# Altium schematic sheet ESP32_DevKitC_v4.SchDoc
size 513 x 386 mm
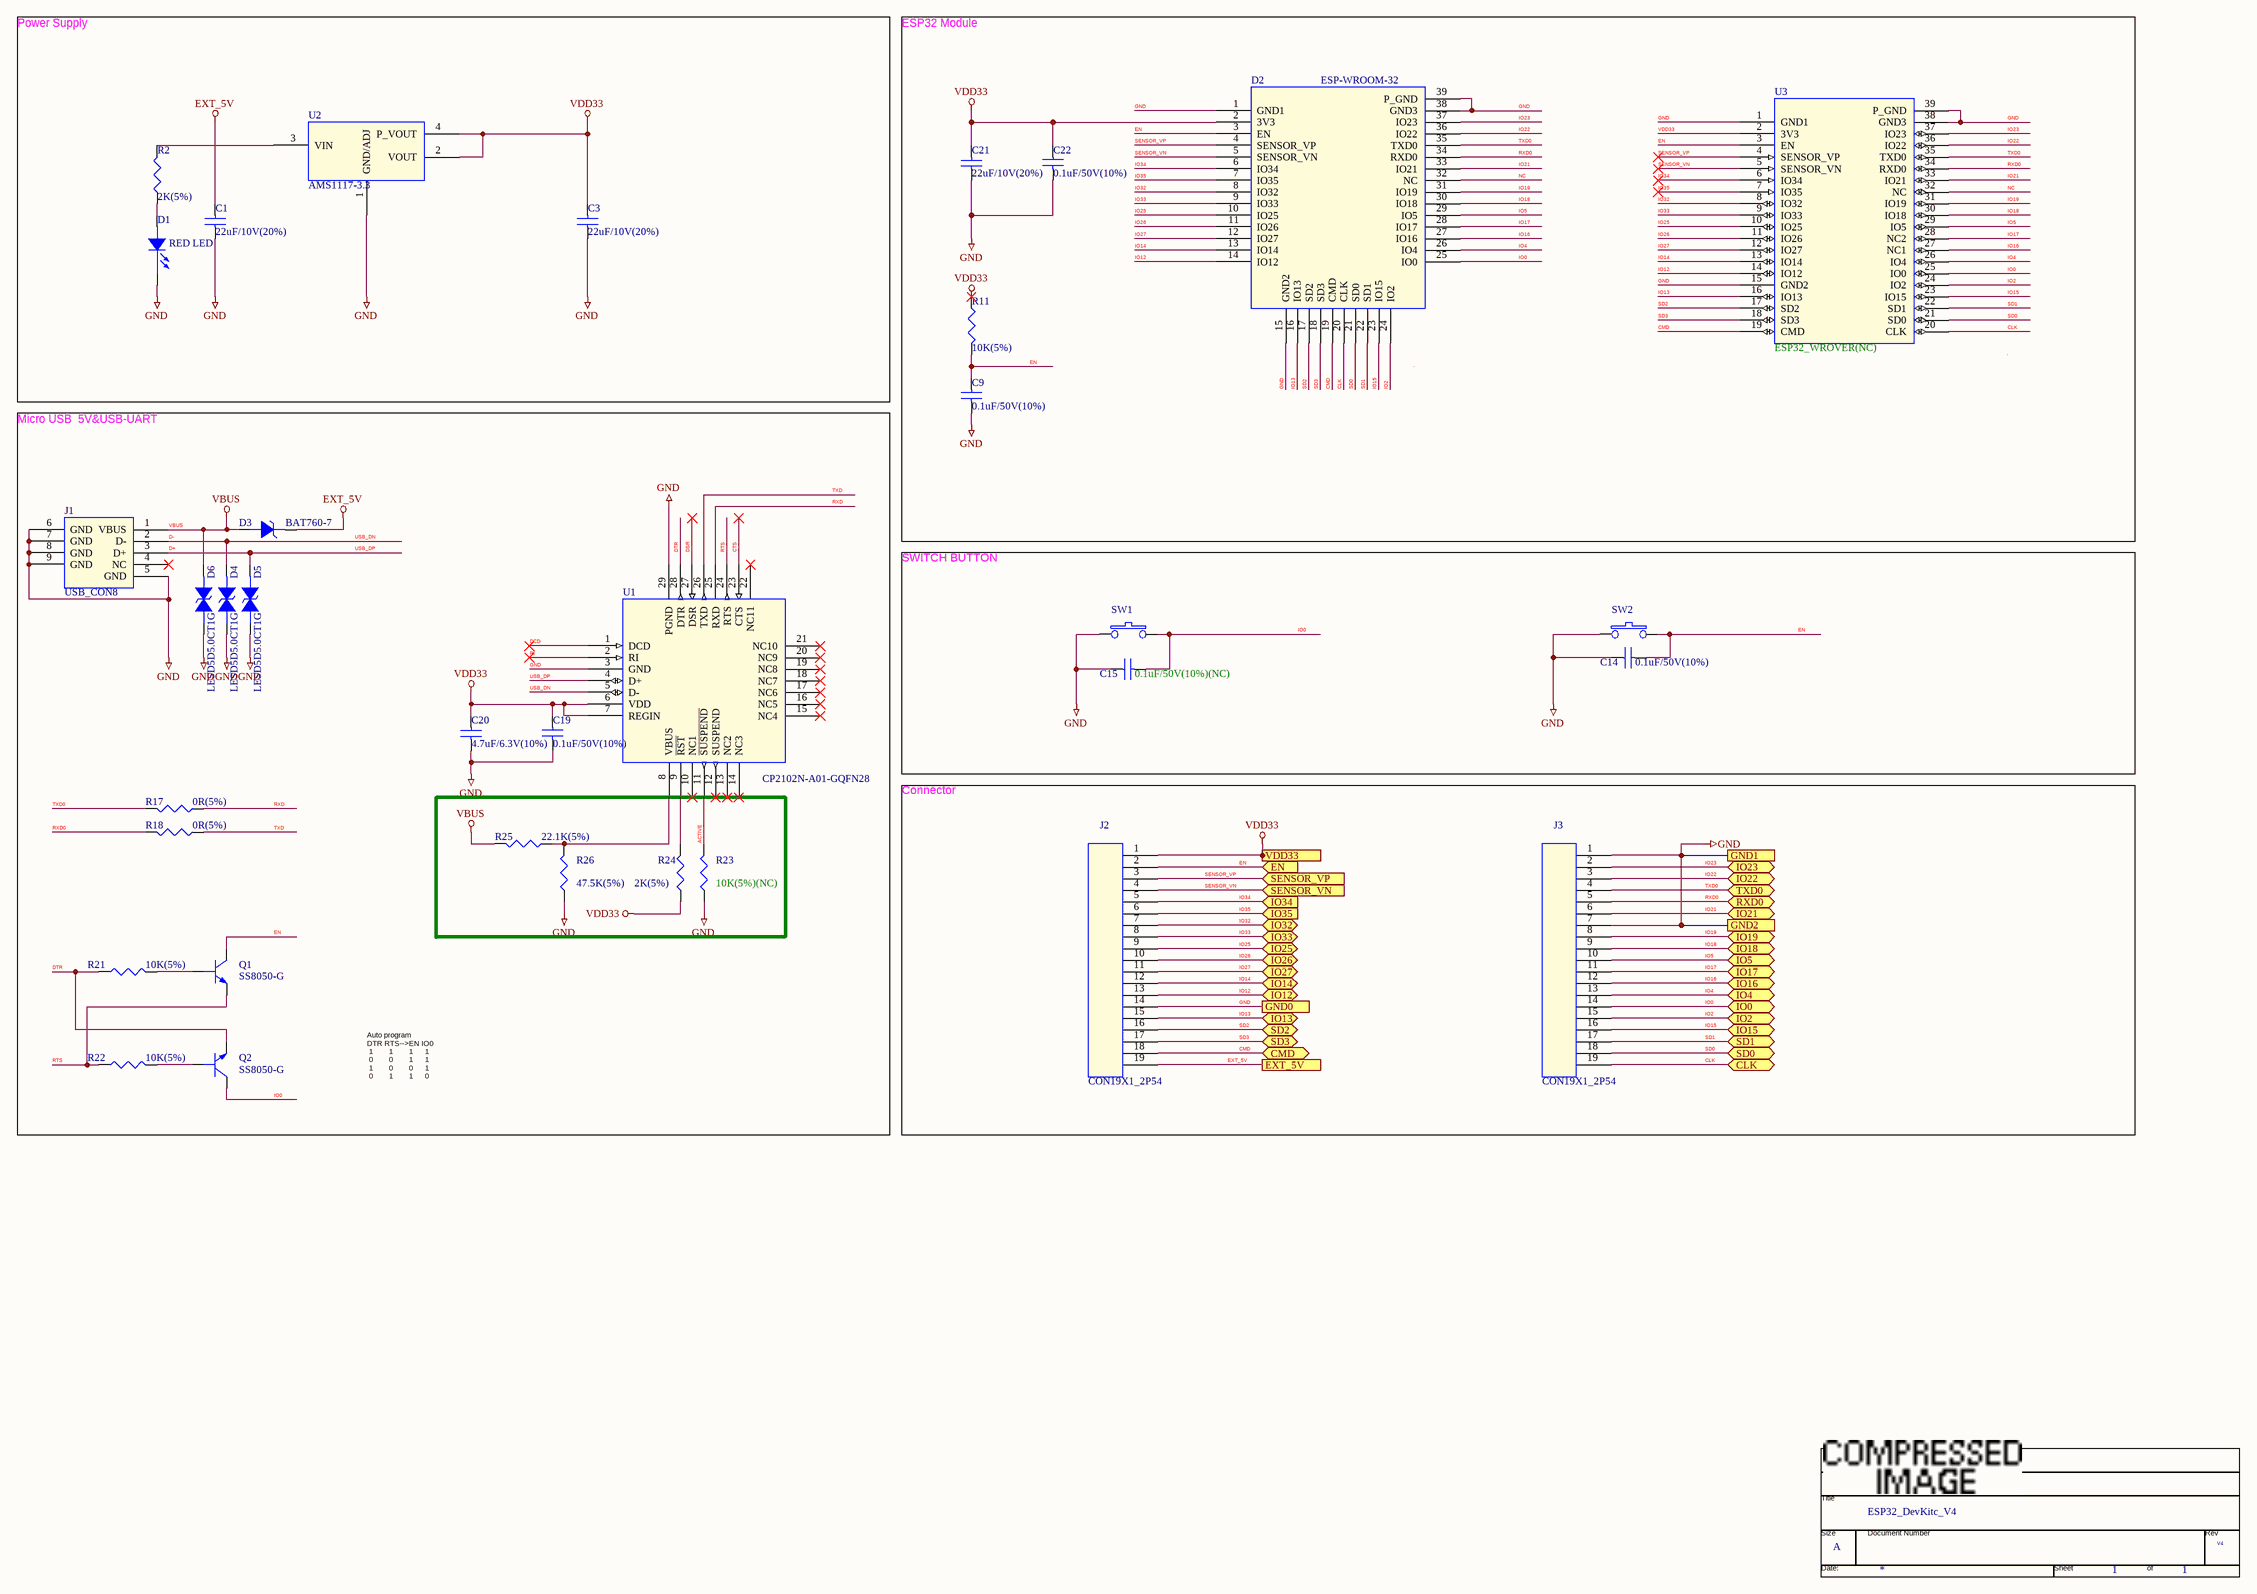
[diagram p0: ESP32_DevKitC_v4.SchDoc]

## Parts
*  RevCode: V4  Title: ESP32_DevKitc_V4  Page Size: A  Page Number: 1  (hidden comment: TitleBlock0)  (graphical)
C1  22uF/10V(20%)  [C0603]
C3  22uF/10V(20%)  [C0603]
C9  0.1uF/50V(10%)  [C0402]
C14  0.1uF/50V(10%)  [C0402]
C15  0.1uF/50V(10%)(NC)  [C0402]
C19  0.1uF/50V(10%)  [C0402]
C20  4.7uF/6.3V(10%)  [C0402]
C21  22uF/10V(20%)  [C0603]
C22  0.1uF/50V(10%)  [C0402]
D1  RED LED  [0603D/A]
D2  ESP-WROOM-32  [ESP32_MODULE]
D3  BAT760-7  [SOD323]
D4  LESD5D5.0CT1G  [ESD0402]
D5  LESD5D5.0CT1G  [ESD0402]
D6  LESD5D5.0CT1G  [ESD0402]
J1  USB_CON8  [USB_5P]
J2  CON19X1_2P54  [CON19_2P54]
J3  CON19X1_2P54  [CON19_2P54]
Q1  SS8050-G  [SOT-23-3]
Q2  SS8050-G  [SOT-23-3]
R2  2K(5%)  [R0402]
R11  10K(5%)  [R0402]
R17  0R(5%)  [R0402]
R18  0R(5%)  [R0402]
R21  10K(5%)  [R0402]
R22  10K(5%)  [R0402]
R23  10K(5%)(NC)  [R0402]
R24  2K(5%)  [R0402]
R25  22.1K(5%)  [R0402]
R26  47.5K(5%)  [R0402]
SW1  SW PUSHBUTTON  [SW_3X4X2MM]  (value not drawn)
SW2  SW PUSHBUTTON  [SW_3X4X2MM]  (value not drawn)
U1  CP2102N-A01-GQFN28  [CP2102_QFN_28P]
U2  AMS1117-3.3  [SOT-223]
U3  ESP32_WROVER(NC)  [ESP32_MODULE_2COL]

## Blocks framed on the sheet
Power Supply: C1 C3 D1 R2 U2
ESP32 Module: C9 C21 C22 D2 R11 U3
Micro USB  5V&USB-UART: C19 C20 D3-D6 J1 Q1 Q2 R17 R18 R21-R26 U1
SWITCH BUTTON: C14 C15 SW1 SW2
Connector: J2 J3

## Ports
CLK (bidir), CMD (bidir), EN (in), EXT_5V, GND0, GND1, GND2, IO0 (bidir), IO2 (bidir), IO4 (bidir), IO5 (bidir), IO12 (bidir), IO13 (bidir), IO14 (bidir), IO15 (bidir), IO16 (bidir), IO17 (bidir), IO18 (bidir), IO19 (bidir), IO21 (bidir), IO22 (bidir), IO23 (bidir), IO25 (bidir), IO26 (bidir), IO27 (bidir), IO32 (bidir), IO33 (bidir), IO34 (in), IO35 (in), RXD0 (bidir), SD0 (bidir), SD1 (bidir), SD2 (bidir), SD3 (bidir), SENSOR_VN (in), SENSOR_VP (in), TXD0 (bidir), VDD33

## Nets
EXT_5V: C1.2 D3.1 J2.19 ; port EXT_5V
GND: C1.1 C3.1 C9.2 C14.1 C15.1 C19.2 C20.1 C21.1 C22.2 D1.2(CATHODE) D2.1(GND1) D2.15(GND2) D2.38(GND3) D2.39(P_GND) D4.2 D5.2 D6.2 J1.5(GND) J1.6(GND) J1.7(GND) J1.8(GND) J1.9(GND) J2.14 J3.1 J3.7 R23.1 R26.1 SW1.1 SW2.1 U1.3(GND) U1.29(PGND) U2.1(GND/ADJ) U3.1(GND1) U3.15(GND2) U3.38(GND3) U3.39(P_GND) ; port GND1, port GND0, port GND2
VBUS: D3.2 D6.1 J1.1(VBUS) R25.2
VDD33: C3.2 C19.1 C20.2 C21.2 C22.1 D2.2(3V3) J2.1 R11.1 R24.1 U1.6(VDD) U1.7(REGIN) U2.2(VOUT) U2.4(P_VOUT) U3.2(3V3) ; port VDD33
ACTIVE: R23.2 U1.11(~{SUSPEND})
CLK: D2.20(CLK) J3.19 U3.20(CLK) ; port CLK
CMD: D2.19(CMD) J2.18 U3.19(CMD) ; port CMD
CTS: U1.23(CTS)
D+: D5.1 J1.3(D+) U1.4(D+)  [also labelled USB_DP]
D-: D4.1 J1.2(D-) U1.5(D-)  [also labelled USB_DN]
DCD: U1.1(DCD)
DSR: U1.27(DSR)
DTR: Q2.2(E) R21.1 U1.28(DTR)
EN: C9.1 C14.2 D2.3(EN) J2.2 Q1.3(C) R11.2 SW2.2 U3.3(EN) ; port EN
IO0: C15.2 D2.25(IO0) J3.14 Q2.3(C) SW1.2 U3.25(IO0) ; port IO0
IO2: D2.24(IO2) J3.15 U3.24(IO2) ; port IO2
IO4: D2.26(IO4) J3.13 U3.26(IO4) ; port IO4
IO5: D2.29(IO5) J3.10 U3.29(IO5) ; port IO5
IO12: D2.14(IO12) J2.13 U3.14(IO12) ; port IO12
IO13: D2.16(IO13) J2.15 U3.16(IO13) ; port IO13
IO14: D2.13(IO14) J2.12 U3.13(IO14) ; port IO14
IO15: D2.23(IO15) J3.16 U3.23(IO15) ; port IO15
IO16: D2.27(IO16) J3.12 U3.27(NC1) ; port IO16
IO17: D2.28(IO17) J3.11 U3.28(NC2) ; port IO17
IO18: D2.30(IO18) J3.9 U3.30(IO18) ; port IO18
IO19: D2.31(IO19) J3.8 U3.31(IO19) ; port IO19
IO21: D2.33(IO21) J3.6 U3.33(IO21) ; port IO21
IO22: D2.36(IO22) J3.3 U3.36(IO22) ; port IO22
IO23: D2.37(IO23) J3.2 U3.37(IO23) ; port IO23
IO25: D2.10(IO25) J2.9 U3.10(IO25) ; port IO25
IO26: D2.11(IO26) J2.10 U3.11(IO26) ; port IO26
IO27: D2.12(IO27) J2.11 U3.12(IO27) ; port IO27
IO32: D2.8(IO32) J2.7 U3.8(IO32) ; port IO32
IO33: D2.9(IO33) J2.8 U3.9(IO33) ; port IO33
IO34: D2.6(IO34) J2.5 U3.6(IO34) ; port IO34
IO35: D2.7(IO35) J2.6 U3.7(IO35) ; port IO35
NC: D2.32(NC) U3.32(NC)
RI: U1.2(RI)
RTS: Q1.2(E) R22.1 U1.24(RTS)
RXD: R17.1 U1.25(RXD)
RXD0: D2.34(RXD0) J3.5 R18.2 U3.34(RXD0) ; port RXD0
SD0: D2.21(SD0) J3.18 U3.21(SD0) ; port SD0
SD1: D2.22(SD1) J3.17 U3.22(SD1) ; port SD1
SD2: D2.17(SD2) J2.16 U3.17(SD2) ; port SD2
SD3: D2.18(SD3) J2.17 U3.18(SD3) ; port SD3
SENSOR_VN: D2.5(SENSOR_VN) J2.4 U3.5(SENSOR_VN) ; port SENSOR_VN
SENSOR_VP: D2.4(SENSOR_VP) J2.3 U3.4(SENSOR_VP) ; port SENSOR_VP
TXD: R18.1 U1.26(TXD)
TXD0: D2.35(TXD0) J3.4 R17.2 U3.35(TXD0) ; port TXD0
NetD1_1: D1.1(ANODE) R2.2
NetQ1_1: Q1.1(B) R21.2
NetQ2_1: Q2.1(B) R22.2
NetR2_1: R2.1 U2.3(VIN)
NetR24_2: R24.2 U1.9(~{RST})
NetR25_1: R25.1 R26.2 U1.8(VBUS)

Not connected (* = marked no-connect by the designer): J1 4(NC)*; U1 10(NC1)* 12(SUSPEND)* 13(NC2)* 14(NC3)* 15(NC4)* 16(NC5)* 17(NC6)* 18(NC7)* 19(NC8)* 20(NC9)* 21(NC10)* 22(NC11)*

## Notes on the sheet
- Auto program
  DTR RTS-->EN IO0
  1        1        1      1
  0        0        1      1
  1        0        0      1
  0        1        1      0
- (in symbol TitleBlock0) Title; Size; Document Number; Rev; Date:; Sheet; of

## Library data of the parts
C1 C3 C9 C14 C15 C19-C22 = CAP NP
  C1 C3 C21: PCB Footprint: C0603
  C9 C14 C15 C19 C20 C22: PCB Footprint: C0402
D1 = LED_1: PCB Footprint: 0603D/A
D2 = ESP32_MODULE_2: PCB Footprint: ESP32_MODULE
D3 = DIODE_POWER_0: PCB Footprint: SOD323
D4-D6 = DIODE BI-DIR TRIG: PCB Footprint: SOD-523; Options: ESD
J1 = CON4_2: PCB Footprint: USB_5P
J2 J3 = CON19_0: PCB Footprint: CON19_2P54
Q1 Q2 = NPN BCE_0: PspiceTemplate: Q^@REFDES %C %B %E; PCB Footprint: SOT-23-3
R2 R11 = RESISTOR_0: PCB Footprint: R0402
R17 R18 R25 = RESISTOR_0: SIGNAL_MODEL: DEFAULT_RESISTOR_10000OHM_1_2; PCB Footprint: R0402
R21-R24 R26 = RESISTOR_0: SIGNAL_MODEL: DEFAULT_RESISTOR_200OHM_1_2; PCB Footprint: R0402
U1 = CP2102_QFN_28: PCB Footprint: CP2102_QFN_28P
U2 = NCP1117_0: PCB Footprint: SOT-223
U3 = ESP32_MODULE_3: PCB Footprint: ESP32_MODULE_2COL
* = TitleBlock0: Page Create Date: March  8, 1995; Page Count: 1; Page Modify Date: *
SW1 SW2 = SW PUSHBUTTON: PCB Footprint: SW_3X4X2MM